# EAGLE design PCB2_new (EAGLE 8.0.1)
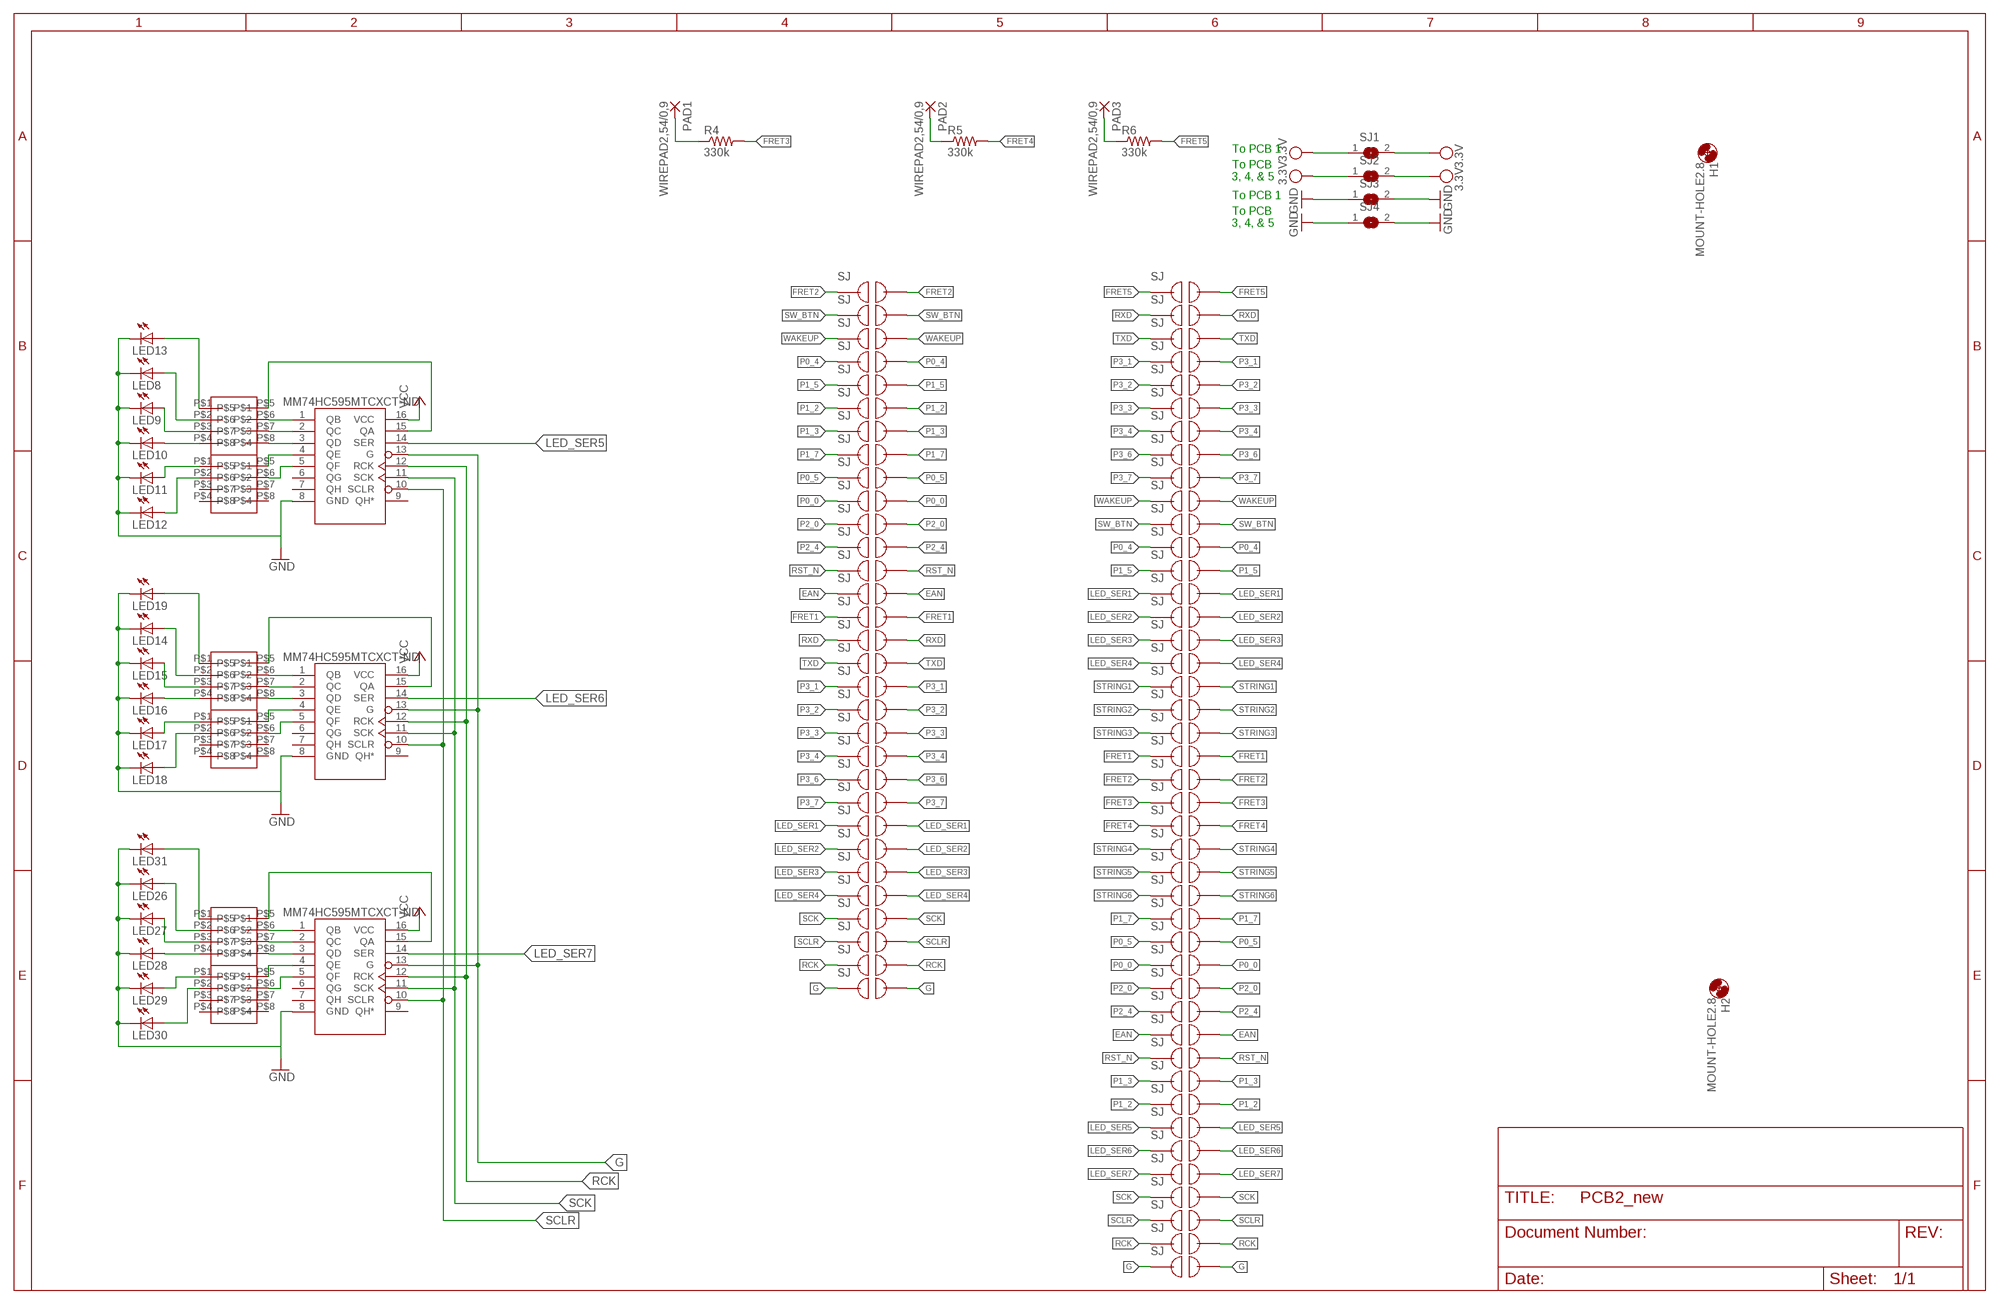
[diagram p0: schematic, sheet 1]

## Parts
H1  MOUNT-HOLE2.8  [2,8]
H2  MOUNT-HOLE2.8  [2,8]
LED8  LEDSMT1206  [1206]
LED9  LEDSMT1206  [1206]
LED10  LEDSMT1206  [1206]
LED11  LEDSMT1206  [1206]
LED12  LEDSMT1206  [1206]
LED13  LEDSMT1206  [1206]
LED14  LEDSMT1206  [1206]
LED15  LEDSMT1206  [1206]
LED16  LEDSMT1206  [1206]
LED17  LEDSMT1206  [1206]
LED18  LEDSMT1206  [1206]
LED19  LEDSMT1206  [1206]
LED26  LEDSMT1206  [1206]
LED27  LEDSMT1206  [1206]
LED28  LEDSMT1206  [1206]
LED29  LEDSMT1206  [1206]
LED30  LEDSMT1206  [1206]
LED31  LEDSMT1206  [1206]
PAD1  WIREPAD2,54/0,9  [2,54/0,9]
PAD2  WIREPAD2,54/0,9  [2,54/0,9]
PAD3  WIREPAD2,54/0,9  [2,54/0,9]
R4  330k  R-US_M0805  [M0805]
R5  330k  R-US_M0805  [M0805]
R6  330k  R-US_M0805  [M0805]
SJ1  SJ  [SJ]
SJ2  SJ  [SJ]
SJ3  SJ  [SJ]
SJ4  SJ  [SJ]
U$1  MM74HC595TSSOP-LD16  [MM74HC595MTCXCT-ND]
U$2  JUMPER  [JUMPER]
U$3  MM74HC595TSSOP-LD16  [MM74HC595MTCXCT-ND]
U$4  JUMPER  [JUMPER]
U$5  MM74HC595TSSOP-LD16  [MM74HC595MTCXCT-ND]
U$6  JUMPER  [JUMPER]
U$7  JUMPER  [JUMPER]
U$8  JUMPER  [JUMPER]
U$9  JUMPER  [JUMPER]
U$10  JUMPER  [JUMPER]
U$11  JUMPER  [JUMPER]
U$12  JUMPER  [JUMPER]
U$13  JUMPER  [JUMPER]
U$14  JUMPER  [JUMPER]
U$15  JUMPER  [JUMPER]
U$16  JUMPER  [JUMPER]
U$17  JUMPER  [JUMPER]
U$18  JUMPER  [JUMPER]
U$19  JUMPER  [JUMPER]
U$20  JUMPER  [JUMPER]
U$21  JUMPER  [JUMPER]
U$22  JUMPER  [JUMPER]
U$23  JUMPER  [JUMPER]
U$24  JUMPER  [JUMPER]
U$25  JUMPER  [JUMPER]
U$26  JUMPER  [JUMPER]
U$27  JUMPER  [JUMPER]
U$28  JUMPER  [JUMPER]
U$29  JUMPER  [JUMPER]
U$30  JUMPER  [JUMPER]
U$31  JUMPER  [JUMPER]
U$32  JUMPER  [JUMPER]
U$33  JUMPER  [JUMPER]
U$34  JUMPER  [JUMPER]
U$35  JUMPER  [JUMPER]
U$36  JUMPER  [JUMPER]
U$37  JUMPER  [JUMPER]
U$38  JUMPER  [JUMPER]
U$39  JUMPER  [JUMPER]
U$40  JUMPER  [JUMPER]
U$41  JUMPER  [JUMPER]
U$42  JUMPER  [JUMPER]
U$43  JUMPER  [JUMPER]
U$44  JUMPER  [JUMPER]
U$45  JUMPER  [JUMPER]
U$46  JUMPER  [JUMPER]
U$47  JUMPER  [JUMPER]
U$48  JUMPER  [JUMPER]
U$49  JUMPER  [JUMPER]
U$50  JUMPER  [JUMPER]
U$51  JUMPER  [JUMPER]
U$52  JUMPER  [JUMPER]
U$53  JUMPER  [JUMPER]
U$54  JUMPER  [JUMPER]
U$55  JUMPER  [JUMPER]
U$56  JUMPER  [JUMPER]
U$57  JUMPER  [JUMPER]
U$58  JUMPER  [JUMPER]
U$59  JUMPER  [JUMPER]
U$60  JUMPER  [JUMPER]
U$61  JUMPER  [JUMPER]
U$62  JUMPER  [JUMPER]
U$63  JUMPER  [JUMPER]
U$64  JUMPER  [JUMPER]
U$65  JUMPER  [JUMPER]
U$66  JUMPER  [JUMPER]
U$67  JUMPER  [JUMPER]
U$68  JUMPER  [JUMPER]
U$69  JUMPER  [JUMPER]
U$70  JUMPER  [JUMPER]
U$71  JUMPER  [JUMPER]
U$72  JUMPER  [JUMPER]
U$73  JUMPER  [JUMPER]
U$74  MNR04MRAPJ680  [MNR04]
U$75  MNR04MRAPJ680  [MNR04]
U$76  MNR04MRAPJ680  [MNR04]
U$77  MNR04MRAPJ680  [MNR04]
U$78  MNR04MRAPJ680  [MNR04]
U$79  MNR04MRAPJ680  [MNR04]
U$80  JUMPER  [JUMPER]
U$81  JUMPER  [JUMPER]
U$82  JUMPER  [JUMPER]
U$83  JUMPER  [JUMPER]

## Nets
EAN: U$37.P$2 U$56.P$1 U$56.P$2
FRET1: U$25.P$2 U$57.P$1 U$57.P$2
FRET2: U$26.P$2 U$43.P$1 U$43.P$2
FRET3: PAD1.1(P) R4.1 R4.2 U$27.P$2
FRET4: PAD2.1(P) R5.1 R5.2 U$28.P$2
FRET5: R6.2 U$2.P$2
G: U$1.13(G) U$3.13(G) U$5.13(G) U$73.P$1 U$73.P$2 U$83.P$1 U$83.P$2
GND: LED8.C LED9.C LED10.C LED11.C LED12.C LED13.C LED14.C LED15.C LED16.C LED17.C LED18.C LED19.C LED26.C LED27.C LED28.C LED29.C LED30.C LED31.C SJ3.1 SJ3.2 SJ4.1 SJ4.2 U$1.8(GND) U$3.8(GND) U$5.8(GND)
LED_SER1: U$18.P$2 U$66.P$1 U$66.P$2
LED_SER2: U$19.P$2 U$67.P$1 U$67.P$2
LED_SER3: U$20.P$2 U$68.P$1 U$68.P$2
LED_SER4: U$21.P$2 U$69.P$1 U$69.P$2
LED_SER5: U$1.14(SER) U$41.P$2
LED_SER6: U$3.14(SER) U$42.P$2
LED_SER7: U$4.P$1 U$4.P$2 U$5.14(SER)
N$2: LED10.A U$75.P$4
N$3: LED12.A U$74.P$2
N$4: U$1.1(QB) U$75.P$6
N$5: U$1.2(QC) U$75.P$7
N$6: U$1.3(QD) U$75.P$8
N$7: U$1.4(QE) U$74.P$5
N$8: U$1.5(QF) U$74.P$6
N$9: LED16.A U$76.P$4
N$10: U$3.1(QB) U$76.P$6
N$11: U$3.2(QC) U$76.P$7
N$12: U$3.3(QD) U$76.P$8
N$13: U$3.4(QE) U$77.P$5
N$15: U$3.5(QF) U$77.P$6
N$16: LED17.A U$77.P$1
N$17: LED30.A U$79.P$2
N$18: LED28.A U$78.P$4
N$19: U$5.3(QD) U$78.P$8
N$20: U$5.2(QC) U$78.P$7
N$21: U$5.1(QB) U$78.P$6
N$22: U$5.4(QE) U$79.P$5
N$23: U$5.5(QF) U$79.P$6
N$24: U$1.15(QA) U$75.P$5
N$25: LED13.A U$75.P$1
N$26: LED8.A U$75.P$2
N$27: LED9.A U$75.P$3
N$29: LED11.A U$74.P$1
N$31: PAD3.1(P) R6.1
N$40: U$3.15(QA) U$76.P$5
N$41: LED19.A U$76.P$1
N$43: LED14.A U$76.P$2
N$44: LED15.A U$76.P$3
N$49: LED18.A U$77.P$2
N$66: U$5.15(QA) U$78.P$5
N$67: LED31.A U$78.P$1
N$68: LED26.A U$78.P$2
N$69: LED27.A U$78.P$3
N$71: LED29.A U$79.P$1
P0_0: U$34.P$2 U$52.P$1 U$52.P$2
P0_4: U$16.P$2 U$46.P$1 U$46.P$2
P0_5: U$33.P$2 U$51.P$1 U$51.P$2
P1_2: U$40.P$2 U$48.P$1 U$48.P$2
P1_3: U$39.P$2 U$49.P$1 U$49.P$2
P1_5: U$17.P$2 U$47.P$1 U$47.P$2
P1_7: U$32.P$2 U$50.P$1 U$50.P$2
P2_0: U$35.P$2 U$53.P$1 U$53.P$2
P2_4: U$36.P$2 U$54.P$1 U$54.P$2
P3_1: U$8.P$2 U$60.P$1 U$60.P$2
P3_2: U$9.P$2 U$61.P$1 U$61.P$2
P3_3: U$10.P$2 U$62.P$1 U$62.P$2
P3_4: U$11.P$2 U$63.P$1 U$63.P$2
P3_6: U$12.P$2 U$64.P$1 U$64.P$2
P3_7: U$13.P$2 U$65.P$1 U$65.P$2
RCK: U$1.12(RCK) U$3.12(RCK) U$5.12(RCK) U$72.P$1 U$72.P$2 U$82.P$1 U$82.P$2
RST_N: U$38.P$2 U$55.P$1 U$55.P$2
RXD: U$6.P$2 U$58.P$1 U$58.P$2
SCK: U$1.11(SCK) U$3.11(SCK) U$5.11(SCK) U$70.P$1 U$70.P$2 U$80.P$1 U$80.P$2
SCLR: U$1.10(SCLR) U$3.10(SCLR) U$5.10(SCLR) U$71.P$1 U$71.P$2 U$81.P$1 U$81.P$2
STRING1: U$22.P$2
STRING2: U$23.P$2
STRING3: U$24.P$2
STRING4: U$29.P$2
STRING5: U$30.P$2
STRING6: U$31.P$2
SW_BTN: U$15.P$2 U$44.P$1 U$44.P$2
TXD: U$7.P$2 U$59.P$1 U$59.P$2
VCC: U$1.16(VCC) U$3.16(VCC) U$5.16(VCC)
VDD: SJ1.1 SJ1.2 SJ2.1 SJ2.2 ; supply symbol labelled 3.3V
WAKEUP: U$14.P$2 U$45.P$1 U$45.P$2
Unconnected: U$1.6(QG) U$1.7(QH) U$1.9(QH*) U$2.P$1 U$3.6(QG) U$3.7(QH) U$3.9(QH*) U$5.6(QG) U$5.7(QH) U$5.9(QH*) U$6.P$1 U$7.P$1 U$8.P$1 U$9.P$1 U$10.P$1 U$11.P$1 U$12.P$1 U$13.P$1 U$14.P$1 U$15.P$1 U$16.P$1 U$17.P$1 U$18.P$1 U$19.P$1 U$20.P$1 U$21.P$1 U$22.P$1 U$23.P$1 U$24.P$1 U$25.P$1 U$26.P$1 U$27.P$1 U$28.P$1 U$29.P$1 U$30.P$1 U$31.P$1 U$32.P$1 U$33.P$1 U$34.P$1 U$35.P$1 U$36.P$1 U$37.P$1 U$38.P$1 U$39.P$1 U$40.P$1 U$41.P$1 U$42.P$1 U$74.P$3 U$74.P$4 U$74.P$7 U$74.P$8 U$77.P$3 U$77.P$4 U$77.P$7 U$77.P$8 U$79.P$3 U$79.P$4 U$79.P$7 U$79.P$8

## Notes on the sheet
- To PCB 1
- To PCB
  3, 4, & 5
- To PCB 1
- To PCB
  3, 4, & 5

## Library data of the parts
H1 H2 = holes:MOUNT-HOLE: MOUNTING HOLE with drill center marker
LED8-LED19 LED26-LED31 = led:LED: LED OSRAM: - CHIPLED LG R971, LG N971, LY N971, LG Q971, LY Q971, LO R971, LY R971 LH N974, LH R974 LS Q976, LO Q976, LY Q976 LO Q996 - Hyper CHIPLED LW Q18S LB Q993, LB Q99A, LB R99A - SideLED LS A670, LO A670, LY A670, LG A670, LP A670 LB A673, LV A673, LT A673, LW A673 LH A674 LY A675 LS A676, LA A676, LO A676, LY A676, LW A676 LS A679, LY A679, LG A679 - Hyper Micro SIDELED® LS Y876, LA Y876, LO Y876, LY Y876 LT Y87S - SmartLED LW L88C, LW L88S LB L89C, LB L89S, LG L890 LS L89K, LO L89K, LY L89K LS L896, LA L896, LO L896, LY L896 - TOPLED LS T670, LO T670, LY T670, LG T670, LP T670 LSG T670, LSP T670, LSY T670, LOP T670, LYG T670 LG T671, LOG T671, LSG T671 LB T673, LV T673, LT T673, LW T673 LH T674 LS T676, LA T676, LO T676, LY T676, LB T676, LH T676, LSB T676, LW T676 LB T67C, LV T67C, LT T67C, LS T67K, LO T67K, LY T67K, LW E67C LS E67B, LA E67B, LO E67B, LY E67B, LB E67C, LV E67C, LT E67C LW T67C LS T679, LY T679, LG T679 LS T770, LO T770, LY T770, LG T770, LP T770 LB T773, LV T773, LT T773, LW T773 LH T774 LS E675, LA E675, LY E675, LS T675 LS T776, LA T776, LO T776, LY T776, LB T776 LHGB T686 LT T68C, LB T68C - Hyper Mini TOPLED® LB M676 - Mini TOPLED Santana® LG M470 LS M47K, LO M47K, LY M47K Source: http://www.osram.convergy.de LUXEON: - LUMILED® LXK2-PW12-R00, LXK2-PW12-S00, LXK2-PW14-U00, LXK2-PW14-V00 LXK2-PM12-R00, LXK2-PM12-S00, LXK2-PM14-U00 LXK2-PE12-Q00, LXK2-PE12-R00, LXK2-PE12-S00, LXK2-PE14-T00, LXK2-PE14-U00 LXK2-PB12-K00, LXK2-PB12-L00, LXK2-PB12-M00, LXK2-PB14-N00, LXK2-PB14-P00, LXK2-PB14-Q00 LXK2-PR12-L00, LXK2-PR12-M00, LXK2-PR14-Q00, LXK2-PR14-R00 LXK2-PD12-Q00, LXK2-PD12-R00, LXK2-PD12-S00 LXK2-PH12-R00, LXK2-PH12-S00 LXK2-PL12-P00, LXK2-PL12-Q00, LXK2-PL12-R00 Source: www.luxeon.com KINGBRIGHT: KA-3528ASYC Source: www.kingbright.com
PAD1-PAD3 = wirepad:WIREPAD: Wire PAD connect wire on PCB
R4-R6 = rcl:R-US_: RESISTOR, American symbol
SJ1-SJ4 = jumper:SJ: SMD solder JUMPER
U$1 U$3 U$5 = ECE477_Guitutar:MM74HC595
U$2 U$4 U$6-U$73 U$80-U$83 = ECE477_Guitutar:JUMPER
U$74-U$79 = ECE477_Guitutar:MNR04MRAPJ680

## Board
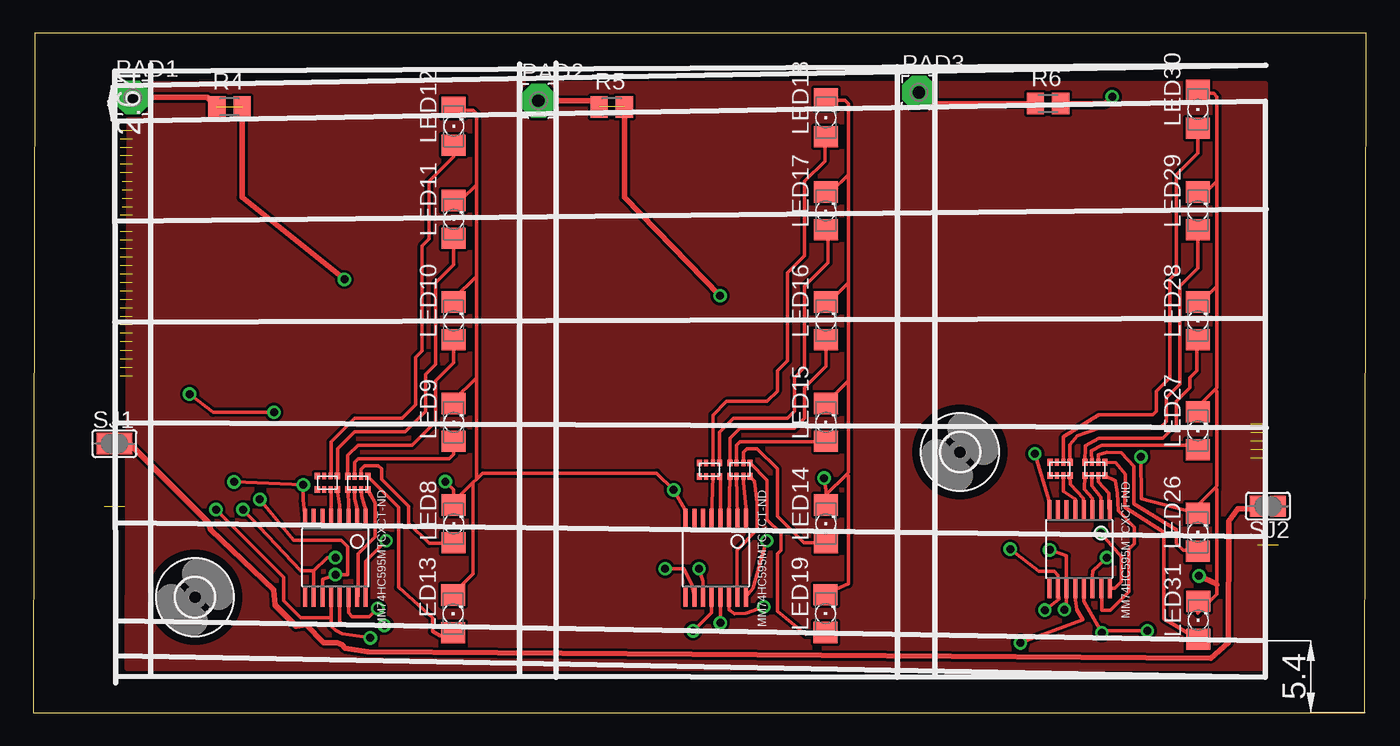
[diagram p1: board, top side]
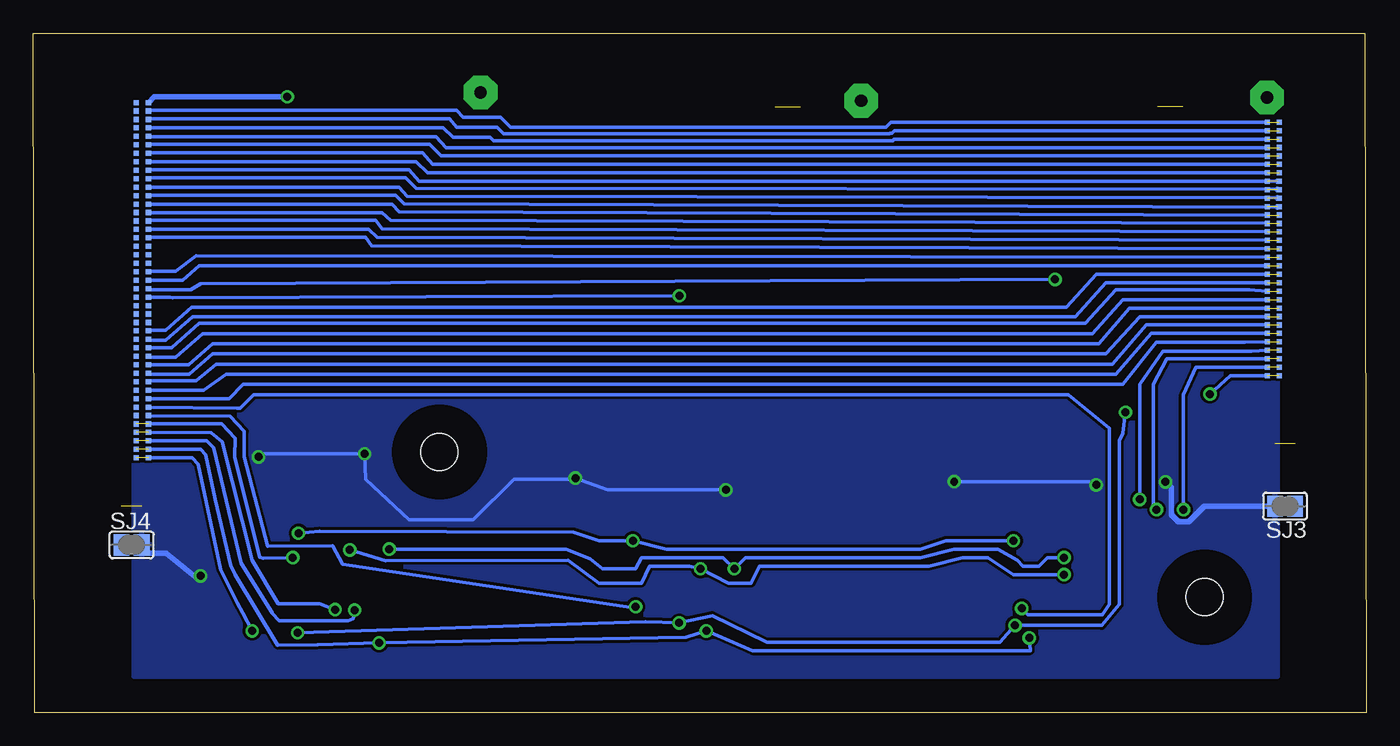
[diagram p2: board, bottom side, seen from below]

Size 100.1 x 50.99 mm. Coordinates in mm from the lower left corner, seen from the top.
Outline: 0,0 100,0 100.1,50.99 0.1,50.99 0,0
Copper layers (1*16): Top 0.035mm / dielectric 1.5mm / Bottom 0.035mm
Design rules "default": minimum track width 10mil, minimum drill 24mil, track to track 8mil, track to pad 8mil, pad to pad 8mil, via to via 8mil, smd to smd 8mil, copper to edge 40mil, drill to drill 8mil, minimum pad ring 10mil, minimum via ring 8mil, stop-mask expansion 4mil, vias tented up to drill 0mil, thermal gap 10mil

### Footprints (pad centres in the part's own frame; a part is rotated, then mirrored left to right if it is on the bottom)
2,8 = hole 2.8: 0,0
1206 = smd 1.6 x 1.803: A -1.422,0; C 1.422,0
2,54/0,9 = drill 0.914 pad 2.54 octagon: 1 0,0
M0805 = smd 1.3 x 1.6: 1 -0.95,0; 2 0.95,0
SJ = smd 1.168 x 1.6: 1 -0.762,0; 2 0.762,0
MM74HC595MTCXCT-ND = smd 0.3 x 1.45: 1 -2.275,-2.95; 2 -1.625,-2.95; 3 -0.975,-2.95; 4 -0.325,-2.95; 5 0.325,-2.95; 6 0.975,-2.95; 7 1.625,-2.95; 8 2.275,-2.95; 9 2.275,2.95; 10 1.625,2.95; 11 0.975,2.95; 12 0.325,2.95; 13 -0.325,2.95; 14 -0.975,2.95; 15 -1.625,2.95; 16 -2.275,2.95
JUMPER = smd 0.381 x 0.381: P$1 -0.454,0; P$2 0.454,0
MNR04 = smd 0.4 x 0.5: P$1 -0.8,-0.5; P$4 0.7,-0.5; P$5 -0.8,0.5; P$8 0.7,0.5 | smd 0.3 x 0.5: P$2 -0.3,-0.5; P$3 0.2,-0.5; P$6 -0.3,0.5; P$7 0.2,0.5

### Placement (x,y rotation side)
H1  12.14,8.66 0 top
H2  69.6,19.56 0 top
LED8  31.58,14.17 90 top
LED9  31.58,21.79 90 top
LED10  31.58,29.41 90 top
LED11  31.58,37.03 90 top
LED12  31.58,44.02 90 top
LED13  31.53,7.41 90 top
LED14  59.52,14.17 90 top
LED15  59.52,21.79 90 top
LED16  59.52,29.41 90 top
LED17  59.52,37.66 90 top
LED18  59.52,44.65 90 top
LED19  59.49,7.43 90 top
LED26  87.46,13.54 90 top
LED27  87.46,21.16 90 top
LED28  87.46,29.41 90 top
LED29  87.46,37.66 90 top
LED30  87.46,45.28 90 top
LED31  87.49,6.93 90 top
PAD1  7.45,46.17 0 top
PAD2  37.93,45.92 0 top
PAD3  66.5,46.55 0 top
R4  14.73,45.47 0 top
R5  43.43,45.47 0 top
R6  76.2,45.72 0 top
SJ1  6.1,20.19 0 top
SJ2  92.72,15.49 180 top
SJ3  6.1,15.49 180 bottom
SJ4  92.72,12.59 0 bottom
U$1  22.69,11.63 180 top
U$2  91.91,45.79 0 bottom
U$3  51.27,11.63 180 top
U$4  91.91,21.66 0 bottom
U$5  78.57,12.27 180 top
U$6  91.91,45.16 0 bottom
U$7  91.91,44.52 0 bottom
U$8  91.91,43.89 0 bottom
U$9  91.91,43.25 0 bottom
U$10  91.91,42.62 0 bottom
U$11  91.91,41.98 0 bottom
U$12  91.91,41.35 0 bottom
U$13  91.91,40.71 0 bottom
U$14  91.91,40.08 0 bottom
U$15  91.91,39.44 0 bottom
U$16  91.91,38.81 0 bottom
U$17  91.91,38.17 0 bottom
U$18  91.91,37.54 0 bottom
U$19  91.91,36.9 0 bottom
U$20  91.91,36.27 0 bottom
U$21  91.91,35.63 0 bottom
U$22  91.91,35 0 bottom
U$23  91.91,34.36 0 bottom
U$24  91.91,33.73 0 bottom
U$25  91.91,33.09 0 bottom
U$26  91.91,32.46 0 bottom
U$27  91.91,31.82 0 bottom
U$28  91.91,31.19 0 bottom
U$29  91.91,30.55 0 bottom
U$30  91.91,29.92 0 bottom
U$31  91.91,29.28 0 bottom
U$32  91.91,28.65 0 bottom
U$33  91.91,28.01 0 bottom
U$34  91.91,27.38 0 bottom
U$35  91.91,26.74 0 bottom
U$36  91.91,26.11 0 bottom
U$37  91.91,25.47 0 bottom
U$38  91.91,24.84 0 bottom
U$39  91.91,24.2 0 bottom
U$40  91.91,23.57 0 bottom
U$41  91.91,22.93 0 bottom
U$42  91.91,22.3 0 bottom
U$43  6.99,33.54 180 bottom
U$44  6.99,38.62 180 bottom
U$45  6.99,39.26 180 bottom
U$46  6.99,37.96 180 bottom
U$47  6.99,37.35 180 bottom
U$48  6.99,27.83 180 bottom
U$49  6.99,28.46 180 bottom
U$50  6.99,32.91 180 bottom
U$51  6.99,32.27 180 bottom
U$52  6.99,31.64 180 bottom
U$53  6.99,31 180 bottom
U$54  6.99,30.37 180 bottom
U$55  6.99,29.1 180 bottom
U$56  6.99,29.73 180 bottom
U$57  6.99,34.18 180 bottom
U$58  6.99,44.32 180 bottom
U$59  6.99,43.69 180 bottom
U$60  6.99,43.05 180 bottom
U$61  6.99,42.42 180 bottom
U$62  6.99,41.78 180 bottom
U$63  6.99,41.15 180 bottom
U$64  6.99,40.51 180 bottom
U$65  6.99,39.88 180 bottom
U$66  6.99,36.72 180 bottom
U$67  6.99,36.08 180 bottom
U$68  6.99,35.45 180 bottom
U$69  6.99,34.81 180 bottom
U$70  6.99,27.19 180 bottom
U$71  6.99,26.56 180 bottom
U$72  6.99,25.92 180 bottom
U$73  6.99,25.29 180 bottom
U$74  22.04,17.26 180 top
U$75  24.32,17.24 180 top
U$76  53.02,18.24 180 top
U$77  50.74,18.22 180 top
U$78  79.68,18.29 180 top
U$79  77.06,18.29 180 top
U$80  91.91,21.03 0 bottom
U$81  91.91,20.39 0 bottom
U$82  91.91,19.76 0 bottom
U$83  91.9,19.12 0 bottom

### Tracks (layer width: path | path; a pad name or v marks a point on that pad's centre or on a via)
EAN  (1 unrouted)
  Bottom 0.254: U$37.P$2 91.38,25.4 88.39,25.4 86.61,26.92 19.56,26.92 17.02,29.72 U$56.P$2
FRET1  (1 unrouted)
  Bottom 0.254: U$25.P$2 91.39,33.12 89.42,33.12 87.88,34.29 U$57.P$2
FRET2  (1 unrouted)
  Bottom 0.254: U$26.P$2 91.37,32.44 88.88,32.44 87.63,33.53 U$43.P$2
FRET3  (via drill 0.6)  (1 unrouted)
  Top 0.406: PAD1.1 13.07,46.17 R4.1 | R4.2 15.68,38.67 v23.37,32.51
  Bottom 0.254: U$27.P$2 91.3,31.76 88.28,31.76 87.53,32.19 v23.37,32.51
FRET4  (via drill 0.6)  (1 unrouted)
  Top 0.406: PAD2.1 42.03,45.92 R5.1 | R5.2 44.38,38.67 v51.58,31.29
  Bottom 0.254: U$28.P$2 90.8,31.18 89.81,31.18 89.65,31.15 v51.58,31.29
FRET5  (via drill 0.6)
  Top 0.406: R6.2 80.52,45.72 v81.03,46.23
  Bottom 0.406: v81.03,46.23 91.02,46.23 U$2.P$2
G  (via drill 0.6)  (2 unrouted)
  Top 0.254: U$1.13 23.02,6.86 23.32,6.55 v26.37,6.55 | v51.59,6.73 51.59,6.88 U$3.13 | U$5.13 78.89,8.35 v80.25,5.99 80.39,6.13 v83.67,6.13 | v18.07,22.54 13.5,22.54 v11.73,23.91
  Bottom 0.254: v80.25,5.99 54.13,6.81 v51.59,6.73 49.11,7.28 45.09,5.3 45.01,5.28 27.52,5.28 v26.37,6.55 19.87,6.55 18.54,8.13 18.54,20.39 18.27,20.98 v18.07,22.54 | v11.73,23.91 10.22,25.27 U$73.P$2 | U$83.P$2 88.19,19.12 87.71,18.64 86.02,10.73 84.77,8.24 84.37,7.51 v83.67,6.13
GND  (via drill 0.6)  (2 unrouted)
  Top 0.254: U$1.8 20.28,15.99 v20.28,17.09 v15.07,17.32 | v30.95,17.34 31.58,16.71 LED8.C 31.58,15.83 33.02,17.27 | U$3.8 48.95,15.21 v48.09,16.71 46.82,17.98 33.73,17.98 33.27,17.53 | v59.39,17.6 59.52,16.71 LED14.C 59.52,16.34 61.09,17.91 | v83.19,19.2 83.23,16.06 87.4,14.95 | 87.4,14.95 LED26.C | U$5.8 76.3,15.81 v75.22,19.43 | LED12.C 31.8,45.21 33.02,45.21 33.27,44.96 33.27,39.62 | 33.27,39.62 32.1,38.45 LED11.C | 33.27,39.62 33.27,32.77 | 33.27,32.77 31.58,31.07 LED10.C | 33.27,32.77 33.27,25.15 | 33.27,25.15 31.58,23.45 LED9.C | 33.27,25.15 33.27,17.53 | 33.27,17.53 33.02,17.27 | 33.02,17.27 33.02,10.41 31.58,8.97 LED13.C | LED18.C 59.62,45.97 60.96,45.97 61.21,45.72 61.21,40.39 | 61.21,40.39 59.91,39.09 LED17.C | 61.21,40.39 61.21,32.26 | 61.21,32.26 59.79,30.83 LED16.C | 61.21,32.26 61.21,24.89 | 61.21,24.89 59.53,23.21 LED15.C | 61.21,24.89 61.21,18.03 61.09,17.91 | LED30.C 87.69,46.48 88.65,46.48 88.9,46.23 88.9,39.88 | 88.9,39.88 88.11,39.09 LED29.C | 88.9,39.88 88.9,32 | 88.9,32 87.73,30.83 LED28.C | 88.9,32 88.9,24.38 88.77,24.26 | 88.77,24.26 87.46,22.94 LED27.C | 88.77,24.26 88.9,24.13 88.9,17.02 88.77,16.89 | 88.77,16.89 87.63,15.75 87.4,14.95 | 88.77,16.89 88.9,16.76 88.9,9.59 88.9,8.89 87.46,7.45 LED31.C | 61.09,17.91 61.21,17.78 61.21,9.65 59.6,8.95 LED19.C
  Top 0.406: v87.54,10.26 88.84,9.65 88.9,9.59
  Bottom 0.254: v20.28,17.09 20.79,17.34 v30.95,17.34 | v48.09,16.71 56.98,16.71 v59.39,17.6 59.47,17.53 64.01,17.53 67.06,14.48 71.88,14.48 75.14,17.52 v75.22,19.43 83.16,19.44 v83.19,19.2
  Bottom 0.406: v87.54,10.26 87.95,10.19 90.13,11.98 91.35,11.98 SJ4.2 | SJ3.2 12.18,15.49 13.34,14.33 14.09,14.33 14.63,14.86 14.63,16.91 v15.07,17.32
  pour Bottom: 6.69,48.46 92.54,48.46 92.54,2.74 6.69,2.74
LED_SER1  (1 unrouted)
  Bottom 0.254: U$18.P$2 91.37,37.5 73.89,37.5 73.28,36.96 U$66.P$2
LED_SER2  (1 unrouted)
  Bottom 0.254: U$19.P$2 91.36,36.97 74.41,36.97 73.91,36.32 U$67.P$2
LED_SER3  (1 unrouted)
  Bottom 0.254: U$20.P$2 91.38,36.3 74.92,36.3 74.3,35.69 U$68.P$2
LED_SER4  (1 unrouted)
  Bottom 0.254: U$21.P$2 91.35,35.67 75.16,35.67 74.68,35.05 U$69.P$2
LED_SER5  (via drill 0.6)
  Top 0.254: U$1.14 23.66,7.48 23.96,7.18 25.23,7.18 v25.86,7.82
  Bottom 0.254: U$41.P$2 84.77,22.86 84.58,22.86 83.57,23.88 22.35,23.88 19.3,21.34 19.3,8.13 19.82,7.36 25.41,7.36 v25.86,7.82
LED_SER6  (via drill 0.6)
  Top 0.254: U$3.14 52.26,7.73 52.64,7.42 53.52,7.44 v54.86,7.95
  Bottom 0.254: v54.86,7.95 55.05,7.87 76.89,11.15 77.64,12.54 82.51,12.48 84.28,19.19 84.26,21.11 85.3,22.26 U$42.P$2
LED_SER7  (via drill 0.6)  (1 unrouted)
  Top 0.254: U$5.14 79.5,9.27 79.53,10.24 79.57,10.64 v80.62,11.63
  Bottom 0.254: v80.62,11.63 82.83,11.58 83.08,11.65 84.96,19.2 84.94,20.6 85.96,21.66 U$4.P$2
N$1
  pour Top: 7.2,47.19 92.54,47.19 92.4,3.34 7.06,3.34
N$2
  Top 0.254: U$75.P$4 23.62,19.3 24.38,20.07 28.45,20.07 30.23,21.84 30.23,24.89 31.58,26.25 LED10.A
N$3
  Top 0.254: U$74.P$2 22.35,17.77 22.35,20.32 24.13,22.1 27.69,22.1 28.7,23.11 28.7,26.67 29.21,27.18 29.21,35.05 29.72,35.56 29.72,39.88 31.58,41.74 LED12.A
N$4
  Top 0.254: U$75.P$6 24.65,16.29 24.84,15.58 24.95,15.28 U$1.1
N$5
  Top 0.254: U$75.P$7 24.14,16.08 24.3,15.31 U$1.2
N$6
  Top 0.254: U$75.P$8 23.64,16.72 23.64,16.35 23.66,15.82 U$1.3
N$7
  Top 0.254: U$74.P$5 23.02,15.56 U$1.4
N$8
  Top 0.254: U$74.P$6 22.36,16.73 U$1.5
N$9
  Top 0.254: U$76.P$4 52.32,20.57 53.09,21.34 57.15,21.34 57.91,22.1 57.91,24.38 59.52,25.99 LED16.A
N$10
  Top 0.254: U$76.P$6 53.31,17.68 53.3,17.7 53.38,16.89 53.52,15.42 53.52,14.72 U$3.1
N$11
  Top 0.254: U$76.P$7 52.89,14.65 U$3.2
N$12
  Top 0.254: U$76.P$8 52.23,14.66 U$3.3
N$13
  Top 0.254: U$3.4 51.59,17.67 U$77.P$5
N$15
  Top 0.254: U$77.P$6 50.94,14.68 U$3.5
N$16
  Top 0.254: LED17.A 59.69,36.07 59.69,33.78 57.91,32 57.91,25.91 57.15,25.15 57.15,22.61 56.64,22.1 52.58,22.1 51.54,21.06 U$77.P$1
N$17
  Top 0.254: LED30.A 87.46,41.99 85.85,40.39 85.85,33.02 85.34,32.51 85.34,25.15 84.33,24.13 84.33,22.61 84.07,22.35 80.01,22.35 77.38,20.7 U$79.P$2
N$18
  Top 0.254: U$78.P$4 79,20.03 80.01,20.57 84.84,20.57 85.85,21.59 85.85,23.37 86.87,24.38 86.87,25.15 87.38,25.65 87.38,27.9 LED28.A
N$19
  Top 0.254: U$5.3 79.52,16.1 78.94,16.78 U$78.P$8
N$20
  Top 0.254: U$5.2 80.26,15.28 80.26,15.49 80.17,16.15 79.5,17.02 U$78.P$7
N$21
  Top 0.254: U$5.1 80.77,15.29 80.77,15.49 80.77,16.45 79.99,17.34 U$78.P$6
N$22
  Top 0.254: U$5.4 78.84,16.07 77.88,17.16 U$79.P$5
N$23
  Top 0.254: U$5.5 78.25,16 77.34,16.62 U$79.P$6
N$24
  Top 0.254: U$1.15 24.38,8.75 24.38,11.94 25.65,13.21 25.65,15.75 25.38,16.28 U$75.P$5
N$25
  Top 0.254: U$75.P$1 27.43,15.43 27.43,9.4 29.97,7.11 29.97,6.1 30.56,5.76 LED13.A
N$26
  Top 0.254: LED8.A 31.53,12.7 29.72,12.7 28.19,14.22 28.19,15.49 26.16,17.53 26.16,18.29 25.91,18.54 24.89,18.54 24.62,18.27 | 24.62,18.27 24.62,18.16 | U$75.P$2 24.62,18.27
N$27
  Top 0.254: U$75.P$3 24.13,18.8 24.38,19.05 31.24,19.05 31.58,19.39 LED9.A
N$29
  Top 0.254: U$74.P$1 22.86,17.78 22.86,19.81 24.13,21.08 27.94,21.08 29.46,22.61 29.46,25.4 30.23,26.16 30.23,32.26 31.58,33.61 LED11.A
N$31
  Top 0.406: R6.1 67.34,45.72 PAD3.1
N$40
  Top 0.254: U$76.P$5 54.15,17.36 54.36,15.75 54.36,13.72 52.83,12.19 52.83,8.74 U$3.15
N$41
  Top 0.254: LED19.A 58,5.87 55.88,7.62 55.88,11.94 56.13,12.19 56.13,13.46 55.12,14.48 55.12,17.45 U$76.P$1
N$43
  Top 0.254: LED14.A 57.86,12.75 55.88,14.73 55.88,18.29 54.36,19.81 53.59,19.81 53.32,19.54 U$76.P$2
N$44
  Top 0.254: U$76.P$3 52.82,20.06 53.09,20.32 59.47,20.32 LED15.A
N$49
  Top 0.254: LED18.A 59.44,43.14 59.44,41.4 57.91,39.88 57.91,34.29 56.64,33.02 56.64,26.42 55.88,25.65 55.88,24.13 55.12,23.37 52.07,23.37 51.04,22.34 U$77.P$2
N$66
  Top 0.254: 80.19,8.73 U$5.15 80.26,9.38 80.26,7.67 80.89,7.67 82.28,9.07 82.28,12.26 82.7,12.68 82.7,13.92 81.48,15.14 81.41,16.46 81.27,17.42 U$78.P$5
N$67
  Top 0.254: LED31.A 84.92,7.03 84.92,13.54 81.99,15.4 82,17.91 81.31,18.75 U$78.P$1
N$68
  Top 0.254: U$78.P$2 79.99,19.34 80.62,19.56 81.7,19.52 82.64,18.5 82.64,15.68 85.85,13.72 85.85,12.7 86.36,12.19 87.38,12.19 LED26.A
N$69
  Top 0.254: U$78.P$3 79.47,19.66 80.26,20.07 87.13,20.07 LED27.A
N$71
  Top 0.254: LED29.A 87.46,33.36 86.11,32 86.11,24.64 85.09,23.62 85.09,21.84 84.58,21.34 80.01,21.34 78.41,20.77 77.86,20.11 U$79.P$1
P0_0  (1 unrouted)
  Bottom 0.254: U$52.P$2 8.82,31.74 9.04,31.74 8.79,31.75 18.8,31.75 21.08,29.21 87.63,29.21 89.72,27.38 U$34.P$2
P0_4  (1 unrouted)
  Bottom 0.254: U$16.P$2 91.38,38.85 72.89,38.85 72.25,38.21 6.66,37.95
  Bottom 0.406: U$46.P$1 6.66,37.96 6.66,37.95
P0_5  (1 unrouted)
  Bottom 0.254: U$33.P$2 91.38,27.94 90.17,27.94 88.14,29.72 21.84,29.72 19.56,32.26 U$51.P$2
P1_2  (1 unrouted)
  Bottom 0.254: U$48.P$2 9.1,27.81 15.76,27.81 18.29,24.64 84.33,24.64 85.4,23.57 U$40.P$2
P1_3  (1 unrouted)
  Bottom 0.254: U$49.P$2 16.15,28.46 18.8,25.4 85.6,25.4 87.3,24.2 U$39.P$2
P1_5  (1 unrouted)
  Bottom 0.254: U$17.P$2 91.38,38.16 73.15,38.16 72.64,37.59 U$47.P$2
P1_7  (1 unrouted)
  Bottom 0.254: U$32.P$2 91.4,28.7 90.17,28.7 88.21,30.41 22.52,30.41 20.28,32.89 U$50.P$2
P2_0  (1 unrouted)
  Bottom 0.254: U$35.P$2 91.38,26.67 89.41,26.67 87.38,28.45 20.57,28.45 18.29,30.99 U$53.P$2
P2_4  (1 unrouted)
  Bottom 0.254: U$54.P$2 8.53,30.37 8.79,30.34 17.78,30.34 20.07,27.69 86.61,27.69 88.45,26.11 U$36.P$2
P3_1  (1 unrouted)
  Bottom 0.254: U$8.P$2 91.4,43.89 69.34,43.89 68.58,43.18 65.79,43.18 65.53,42.93 35.56,42.93 35.46,43.03 35.44,43.03 35.41,43.05 U$60.P$2
P3_2  (1 unrouted)
  Bottom 0.254: U$9.P$2 91.38,43.23 69.85,43.23 69.09,42.42 U$61.P$2
P3_3  (1 unrouted)
  Bottom 0.254: U$10.P$2 91.37,42.65 70.33,42.65 69.47,41.78 U$62.P$2
P3_4  (1 unrouted)
  Bottom 0.254: U$11.P$2 91.38,42.02 70.87,42.02 70.1,41.15 U$63.P$2
P3_6  (1 unrouted)
  Bottom 0.254: U$12.P$2 91.38,41.35 71.36,41.35 70.48,40.51 U$64.P$2
P3_7  (1 unrouted)
  Bottom 0.254: U$13.P$2 91.38,40.75 71.88,40.75 71.13,39.89 6.68,39.89
  Bottom 0.406: U$65.P$1 6.68,39.88 6.68,39.89
RCK  (via drill 0.6)  (2 unrouted)
  Top 0.254: U$1.12 22.36,7.11 | 22.36,7.11 22.36,6.49 22.69,6.17 23.2,5.92 v25.31,5.6 | U$3.12 50.94,7.5 49.99,6.55 v49.55,6.13 | v74.13,5.23 78.82,6.99 78.36,7.72 78.27,8.47 U$5.12 | 22.36,7.11 20.07,7.11 18.8,8.38 18.8,10.16 v13.72,15.24
  Bottom 0.254: v25.31,5.6 25.23,4.64 46.11,4.64 v49.55,6.13 51.1,5.64 v74.13,5.23 78.77,5.11 81.74,5.07 84.92,10.35 85.28,11.07 86.42,16.03 87.15,19.37 87.54,19.76 U$82.P$2 | v13.72,15.24 13.72,23.88 12.81,25.93 9.17,25.93 U$72.P$2
RST_N  (1 unrouted)
  Bottom 0.254: U$38.P$2 91.4,24.89 87.88,24.89 86.36,26.16 19.05,26.16 16.51,29.1 U$55.P$2
RXD  (1 unrouted)
  Bottom 0.254: U$6.P$2 91.4,45.21 68.33,45.21 67.82,44.7 65.02,44.7 64.26,43.94 36.07,43.94 35.69,44.32 U$58.P$2
SCK  (via drill 0.6)  (2 unrouted)
  Top 0.254: U$1.11 21.71,10.02 v22.69,10.36 23.62,10.36 23.62,12.45 23.11,12.95 19.56,12.95 v17.02,16 | U$3.11 50.29,9.87 v49.99,10.8 | v76.33,12.21 77.59,11.77 U$5.11 77.58,8.79 77.6,8.7 77.57,8.23 77.48,7.85 v77.43,7.73
  Bottom 0.254: v22.69,10.36 26.5,10.36 28.41,11.63 30.31,11.63 32.85,10.99 45.55,10.99 46.19,9.72 47.89,9.72 v49.99,10.8 50.83,10.99 53.8,10.99 54.44,9.72 57.62,9.72 59.96,11.43 73.66,11.39 v76.33,12.21 | v17.02,16 17.02,24.64 15.28,27.14 8.62,27.14 U$70.P$2 | U$80.P$2 86.72,21 85.9,20.33 83.68,11.43 81.71,8.15 78.59,8.15 v77.43,7.73
SCLR  (via drill 0.6)  (2 unrouted)
  Top 0.254: U$1.10 21.07,10.64 | v22.69,11.63 22.05,11.63 21.07,10.64 | U$3.10 49.47,9.48 49.47,9.54 48.85,10.8 v47.45,10.8 | v73.36,12.27 75.54,10.6 76.67,10.6 76.94,10.32 U$5.10 77.02,8.49 v75.97,7.7 | 21.07,10.64 20.09,10.64 v15.75,15.24
  Bottom 0.254: v22.69,11.63 23.96,11.63 24.59,10.99 25.77,10.99 26.21,11.43 27.68,12.27 30.95,12.27 33.48,11.63 46.62,11.63 v47.45,10.8 48.29,11.63 54.44,11.63 54.88,10.8 57.35,10.8 58.28,11.53 60.09,12.27 v73.36,12.27 | U$71.P$2 14.99,26.56 16,24.64 16,15.49 v15.75,15.24 | U$81.P$2 87.09,20.39 86.54,19.89 84.48,11.2 82.18,7.48 82.18,7.47 81.64,6.9 76.45,6.9 76.07,7.04 v75.97,7.7
SW_BTN  (1 unrouted)
  Bottom 0.254: U$15.P$2 91.35,39.42 72.62,39.42 72.02,38.75 6.66,38.65
  Bottom 0.406: U$44.P$1 6.66,38.62 6.66,38.65
TXD  (1 unrouted)
  Bottom 0.254: U$7.P$2 91.38,44.58 68.83,44.58 68.33,43.94 65.28,43.94 64.77,43.43 35.81,43.43 35.76,43.48 35.62,43.48 35.42,43.69 U$59.P$2
VCC  (via drill 0.6)
  Top 0.254: U$3.16 54.03,9.31 v55.08,12.9 | v80.18,13.46 81.74,11.66 81.71,11.63 81.71,9.82 81.56,9.66 81.56,9.65 81.22,9.31 U$5.16 | v26.5,12.9 24.96,11.37 U$1.16
  Bottom 0.254: v80.18,13.46 78.59,13.6 59.52,13.54 57.62,12.9 v55.08,12.9 52.53,12.27 33.48,12.27 31.58,12.9 v26.5,12.9
VDD  (2 unrouted)
  Top 0.406: SJ1.2 7.27,20.14 13.14,14.28 13.33,13.73 18.06,9.23 18.15,8.05 19.73,6.46 20.5,6.58 21.82,5.26 22.82,5.26 23.19,5.09 23.41,4.84 25.1,4.58 88.44,4.09 89.75,5.26 89.78,14.35 90.47,15.32 91.78,15.32 SJ2.2
WAKEUP  (1 unrouted)
  Bottom 0.254: U$14.P$2 91.4,40.13 72.14,40.13 71.36,39.36 6.69,39.27
  Bottom 0.406: U$45.P$1 6.69,39.26 6.69,39.27